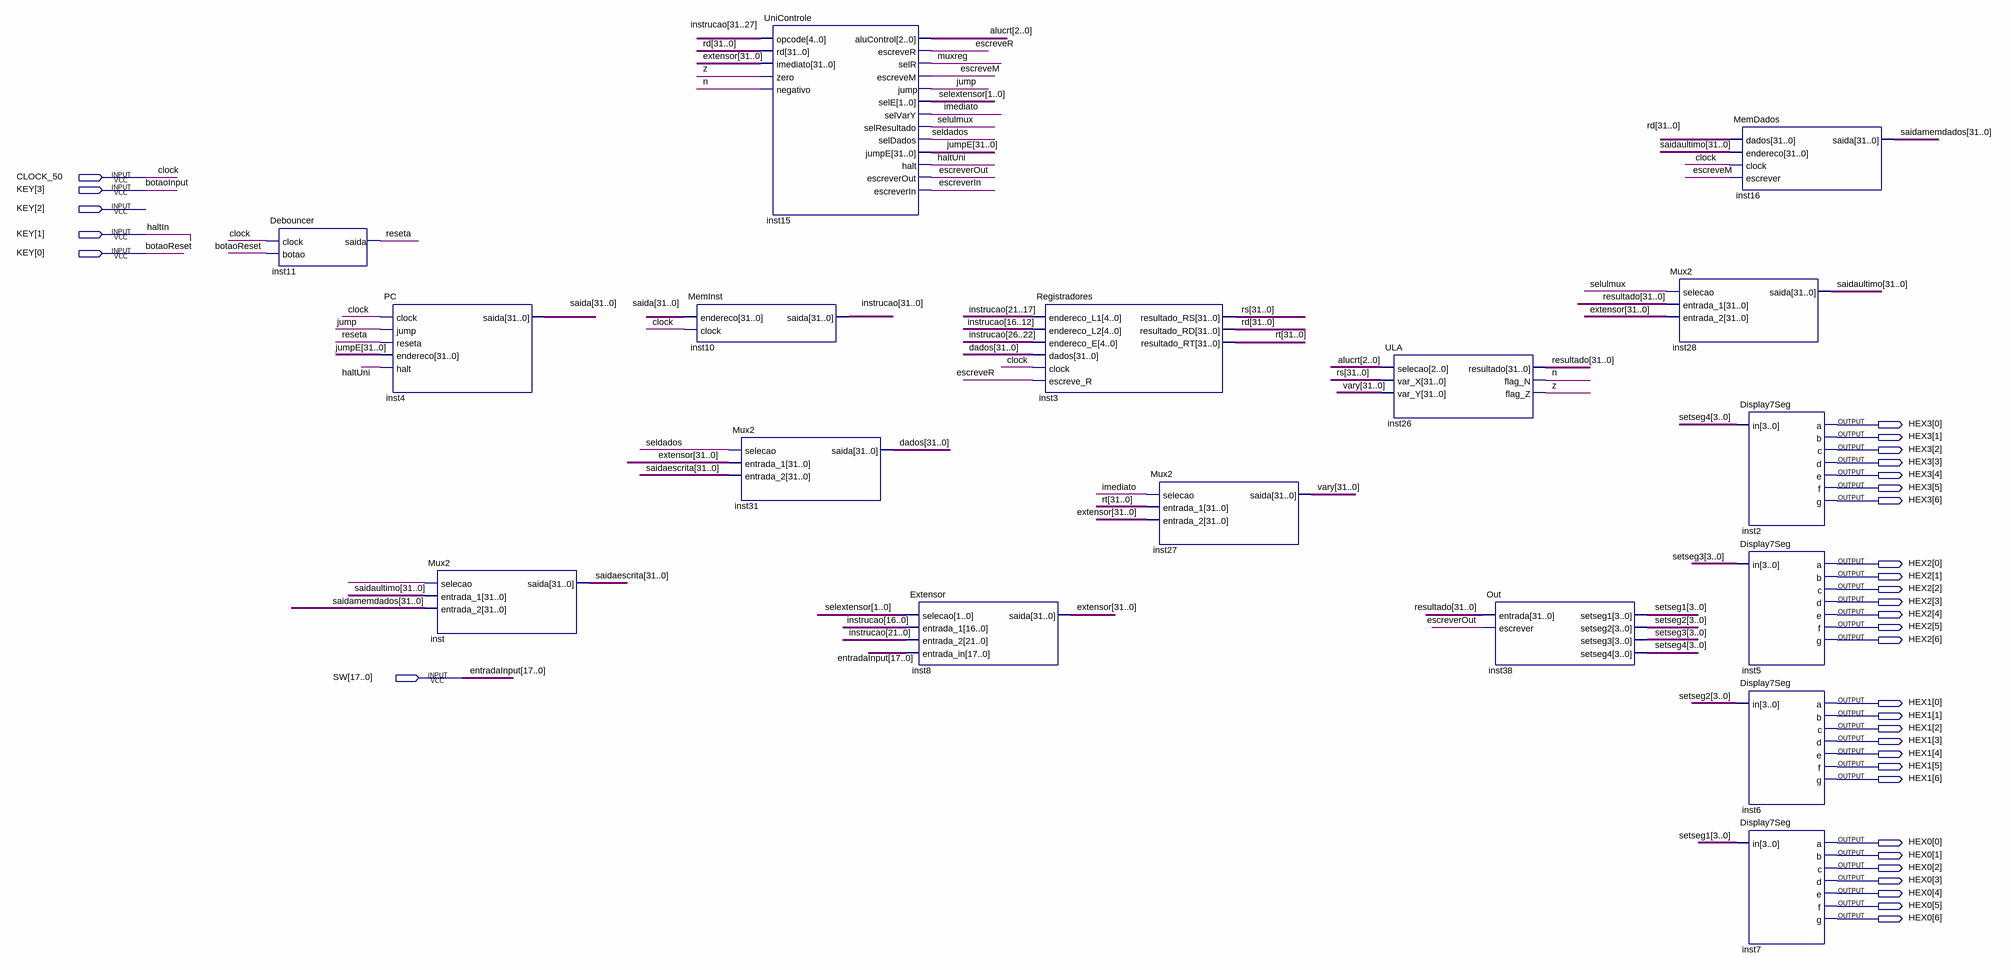
[diagram p0: schematic sheet]
// Quartus schematic verilogbdf.bdf as structural Verilog: 17 symbols, 34 pins
module verilogbdf (
  input  CLOCK_50,
  input  [3:0] KEY,
  input  [17:0] SW,
  output [6:0] HEX3,
  output [6:0] HEX2,
  output [6:0] HEX1,
  output [6:0] HEX0
);

  wire escreveM, escreveR, escreverIn, escreverOut, haltUni, imediato, jump, muxreg, n, reseta, seldados,
       selulmux, undriven, z;
  wire [1:0] selextensor;
  wire [2:0] alucrt;
  wire [3:0] setseg1, setseg2, setseg3, setseg4;
  wire [31:0] dados, extensor, instrucao, jumpE, rd, resultado, rs, rt, saida, saidaescrita, saidamemdados,
       saidaultimo, vary;

  Debouncer inst11 (.clock(CLOCK_50), .botao(KEY[0]), .saida(reseta));
  PC inst4 (.clock(CLOCK_50), .jump(jump), .reseta(reseta), .endereco(jumpE), .halt(haltUni), .saida(saida));
  Mux2 inst (.selecao(undriven), .entrada_1(saidaultimo), .entrada_2(saidamemdados), .saida(saidaescrita));
  MemInst inst10 (.endereco(saida), .clock(CLOCK_50), .saida(instrucao));
  Mux2 inst31 (.selecao(seldados), .entrada_1(extensor), .entrada_2(saidaescrita), .saida(dados));
  UniControle inst15 (
    .opcode(instrucao[31:27]), .rd(rd), .imediato(extensor), .zero(z), .negativo(n), .aluControl(alucrt),
    .escreveR(escreveR), .selR(muxreg), .escreveM(escreveM), .jump(jump), .selE(selextensor),
    .selVarY(imediato), .selResultado(selulmux), .selDados(seldados), .jumpE(jumpE), .halt(haltUni),
    .escreverOut(escreverOut), .escreverIn(escreverIn));
  Extensor inst8 (
    .selecao(selextensor), .entrada_1(instrucao[16:0]), .entrada_2(instrucao[21:0]), .entrada_in(SW),
    .saida(extensor));
  Registradores inst3 (
    .endereco_L1(instrucao[21:17]), .endereco_L2(instrucao[16:12]), .endereco_E(instrucao[26:22]),
    .dados(dados), .clock(CLOCK_50), .escreve_R(escreveR), .resultado_RS(rs), .resultado_RD(rd),
    .resultado_RT(rt));
  Mux2 inst27 (.selecao(imediato), .entrada_1(rt), .entrada_2(extensor), .saida(vary));
  ULA inst26 (.selecao(alucrt), .var_X(rs), .var_Y(vary), .resultado(resultado), .flag_N(n), .flag_Z(z));
  Out inst38 (
    .entrada(resultado), .escrever(escreverOut), .setseg1(setseg1), .setseg2(setseg2), .setseg3(setseg3),
    .setseg4(setseg4));
  Mux2 inst28 (.selecao(selulmux), .entrada_1(resultado), .entrada_2(extensor), .saida(saidaultimo));
  MemDados inst16 (.dados(rd), .endereco(saidaultimo), .clock(CLOCK_50), .escrever(escreveM), .saida(saidamemdados));
  Display7Seg inst2 (
    .in(setseg4), .a(HEX3[0]), .b(HEX3[1]), .c(HEX3[2]), .d(HEX3[3]), .e(HEX3[4]), .f(HEX3[5]), .g(HEX3[6]));
  Display7Seg inst5 (
    .in(setseg3), .a(HEX2[0]), .b(HEX2[1]), .c(HEX2[2]), .d(HEX2[3]), .e(HEX2[4]), .f(HEX2[5]), .g(HEX2[6]));
  Display7Seg inst6 (
    .in(setseg2), .a(HEX1[0]), .b(HEX1[1]), .c(HEX1[2]), .d(HEX1[3]), .e(HEX1[4]), .f(HEX1[5]), .g(HEX1[6]));
  Display7Seg inst7 (
    .in(setseg1), .a(HEX0[0]), .b(HEX0[1]), .c(HEX0[2]), .d(HEX0[3]), .e(HEX0[4]), .f(HEX0[5]), .g(HEX0[6]));

  // Other names for the same wires on the sheet: botaoInput = KEY[3]; botaoReset = KEY[0]; clock = CLOCK_50;
  //   entradaInput[17:0] = SW; haltIn = KEY[1]
endmodule
